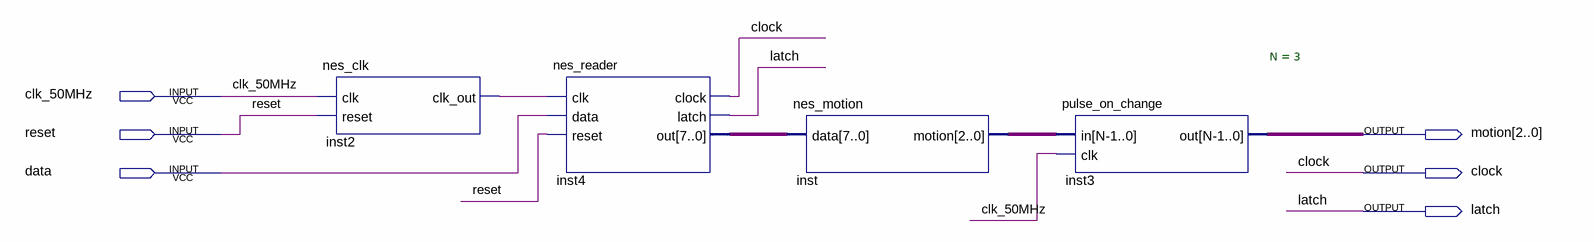
[diagram p0: schematic sheet]
// Quartus schematic nes_block.bdf as structural Verilog: 4 symbols, 6 pins
module nes_block (
  input  clk_50MHz,
  input  reset,
  input  data,
  output [2:0] motion,
  output clock,
  output latch
);

  wire inst2_clk_out;
  wire [2:0] inst_motion;
  wire [7:0] inst4_out;

  nes_clk inst2 (.clk(clk_50MHz), .reset(reset), .clk_out(inst2_clk_out));
  nes_reader inst4 (.clk(inst2_clk_out), .data(data), .reset(reset), .clock(clock), .latch(latch), .out(inst4_out));
  nes_motion inst (.data(inst4_out), .motion(inst_motion));
  pulse_on_change #(.N(3)) inst3 (.in(inst_motion), .clk(clk_50MHz), .out(motion));
endmodule
